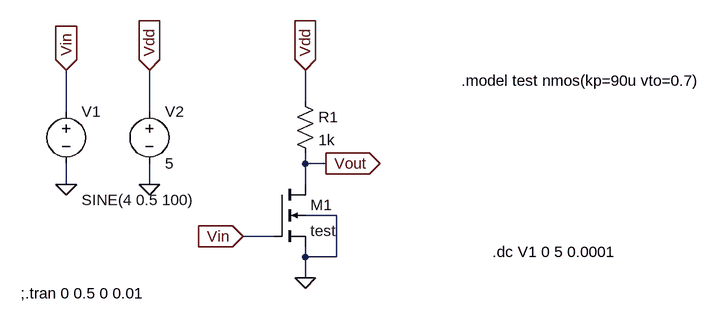
[diagram p0: schematic CS_Rd.asc]
CS_Rd.asc, the LTspice schematic file:
Version 4
SHEET 1 904 680
WIRE 256 64 256 16
WIRE -112 80 -112 16
WIRE 16 80 16 16
WIRE 256 160 256 144
WIRE 288 160 256 160
WIRE -112 192 -112 160
WIRE 16 192 16 160
WIRE 256 192 256 160
WIRE 304 240 256 240
WIRE 208 272 160 272
WIRE 256 304 256 288
WIRE 304 304 304 240
WIRE 304 304 256 304
WIRE 256 336 256 304
FLAG 256 336 0
FLAG -112 192 0
FLAG 16 192 0
FLAG -112 16 Vin
IOPIN -112 16 In
FLAG 16 16 Vdd
IOPIN 16 16 In
FLAG 256 16 Vdd
IOPIN 256 16 In
FLAG 160 272 Vin
IOPIN 160 272 In
FLAG 288 160 Vout
IOPIN 288 160 Out
SYMBOL res 240 48 R0
SYMATTR InstName R1
SYMATTR Value 1k
SYMBOL nmos4 208 192 R0
SYMATTR InstName M1
SYMATTR Value test
SYMATTR Value2 l=1u w=3u
SYMBOL voltage -112 64 R0
WINDOW 3 24 152 Left 2
WINDOW 123 24 124 Left 2
WINDOW 39 0 0 Left 0
SYMATTR InstName V1
SYMATTR Value SINE(4 0.5 100)
SYMBOL voltage 16 64 R0
WINDOW 123 0 0 Left 0
WINDOW 39 0 0 Left 0
SYMATTR InstName V2
SYMATTR Value 5
TEXT 496 32 Left 2 !.model test nmos(kp=90u vto=0.7)
TEXT -182 360 Left 2 !;.tran 0 0.5 0 0.01
TEXT 544 296 Left 2 !.dc V1 0 5 0.0001

The netlist it stands for:
* CS_Rd.asc
R1 Vdd Vout 1k
M1 Vout Vin 0 0 test l=1u w=3u
V1 Vin 0 SINE(4 0.5 100)
V2 Vdd 0 5
.model NMOS NMOS
.model PMOS PMOS
.lib standard.mos
.model test nmos(kp=90u vto=0.7)
;.tran 0 0.5 0 0.01
.dc V1 0 5 0.0001
.backanno
.end

* Results of the author's LTspice run, read from the files saved beside the schematic
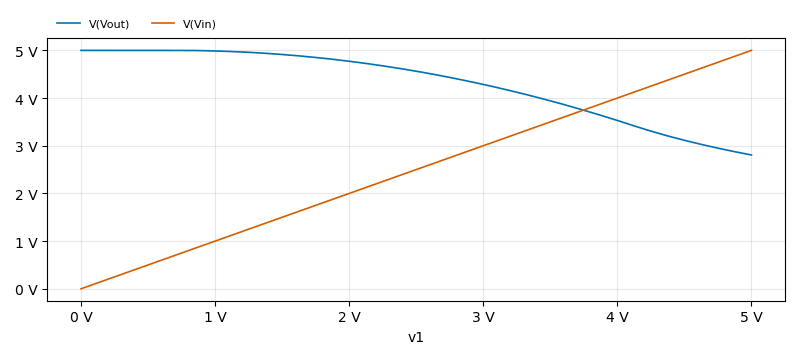
[diagram p1: DC transfer characteristic of CS_Rd.asc, plotted from the saved traces]
* DC transfer characteristic, 1 run:
*   V(Vout): 5 V at v1=0 V, 2.805 V at v1=5 V, min 2.805 V, max 5 V
*   V(Vin): 0 V at v1=0 V, 5 V at v1=5 V, min 0 V, max 5 V